# Altium project Junction Bo 42Pin Conv.PrjPcb
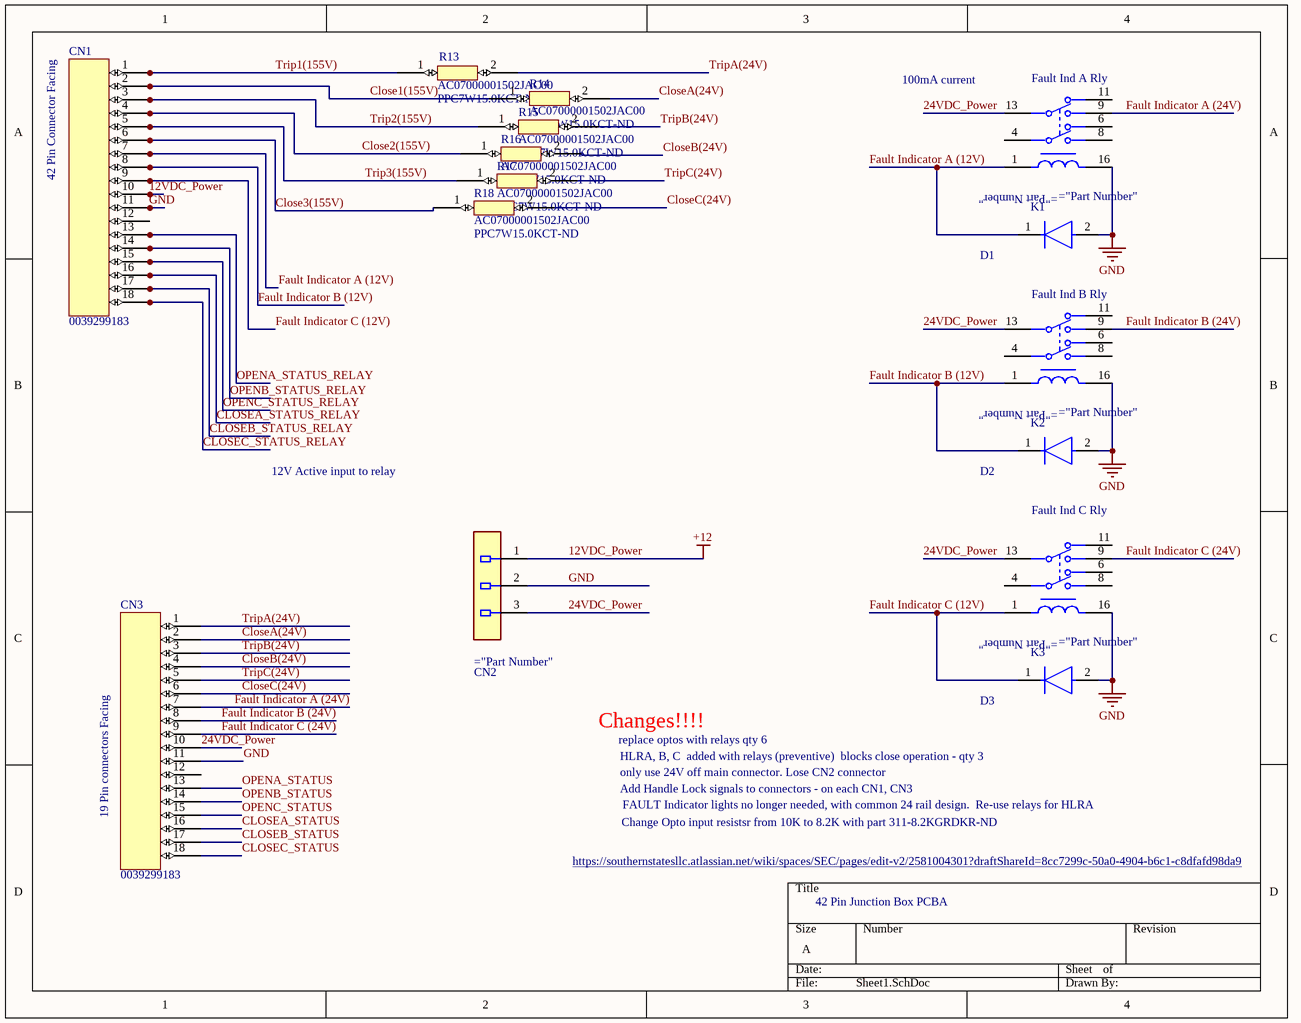
[diagram p0: Sheet1.SchDoc]
2 sheets, 45 parts. Net scope: global (net labels, ports and power ports of the same name join across sheets).
Board file: PCB1.PcbDoc
Sheets:
  Sheet1.SchDoc
  Sheet2.SchDoc

## Sheet Sheet1.SchDoc
size A; SheetNumber: 1; SheetTotal: 2

### Parts
CN1  0039299183  [0039299183]
CN2  15-31-1036  [Molex_15-31-1036_0]  (value not drawn)
CN3  0039299183  [0039299183]
D1  S1A-13-F  [Micro_Commercial_DO-214AC_MFG]  (value not drawn)
D2  S1A-13-F  [Micro_Commercial_DO-214AC_MFG]  (value not drawn)
D3  S1A-13-F  [Micro_Commercial_DO-214AC_MFG]  (value not drawn)
K1  DS2Y-S-DC24V  [Panasonic_DS2Y-S-DC24V_0]  (value not drawn)
K2  DS2Y-S-DC24V  [Panasonic_DS2Y-S-DC24V_0]  (value not drawn)
K3  DS2Y-S-DC24V  [Panasonic_DS2Y-S-DC24V_0]  (value not drawn)
R13  AC07000001502JAC00  Supplier Part Number 1: PPC7W15.0KCT-ND  [AC07000001502JAC00]
R14  AC07000001502JAC00  Supplier Part Number 1: PPC7W15.0KCT-ND  [AC07000001502JAC00]
R15  AC07000001502JAC00  Supplier Part Number 1: PPC7W15.0KCT-ND  [AC07000001502JAC00]
R16  AC07000001502JAC00  Supplier Part Number 1: PPC7W15.0KCT-ND  [AC07000001502JAC00]
R17  AC07000001502JAC00  Supplier Part Number 1: PPC7W15.0KCT-ND  [AC07000001502JAC00]
R18  AC07000001502JAC00  Supplier Part Number 1: PPC7W15.0KCT-ND  [AC07000001502JAC00]

### Nets
12VDC_Power: CN1.10 CN2.1  [also labelled +12]
GND: CN1.11 CN2.2 CN3.11 D1.2(A) D2.2(A) D3.2(A) K1.16(-) K2.16(-) K3.16(-)
24VDC_Power: CN2.3 CN3.10 K1.13(2_COM) K2.13(2_COM) K3.13(2_COM)
Close1(155V): CN1.2 R14.1
Close2(155V): CN1.4 R16.1
Close3(155V): CN1.6 R18.1
CloseA(24V): CN3.2 R14.2
CLOSEA_STATUS: CN3.16
CLOSEA_STATUS_RELAY: CN1.16
CloseB(24V): CN3.4 R16.2
CLOSEB_STATUS: CN3.17
CLOSEB_STATUS_RELAY: CN1.17
CloseC(24V): CN3.6 R18.2
CLOSEC_STATUS: CN3.18
CLOSEC_STATUS_RELAY: CN1.18
Fault Indicator A (12V): CN1.7 D1.1(C) K1.1(+)
Fault Indicator A (24V): CN3.7 K1.9(2_N.O.)
Fault Indicator B (12V): CN1.8 D2.1(C) K2.1(+)
Fault Indicator B (24V): CN3.8 K2.9(2_N.O.)
Fault Indicator C (12V): CN1.9 D3.1(C) K3.1(+)
Fault Indicator C (24V): CN3.9 K3.9(2_N.O.)
OPENA_STATUS: CN3.13
OPENA_STATUS_RELAY: CN1.13
OPENB_STATUS: CN3.14
OPENB_STATUS_RELAY: CN1.14
OPENC_STATUS: CN3.15
OPENC_STATUS_RELAY: CN1.15
Trip1(155V): CN1.1 R13.1
Trip2(155V): CN1.3 R15.1
Trip3(155V): CN1.5 R17.1
TripA(24V): CN3.1 R13.2
TripB(24V): CN3.3 R15.2
TripC(24V): CN3.5 R17.2

Not connected (* = marked no-connect by the designer): CN1 12; CN3 12; K1 4(1_COM) 6(1_N.C.) 8(1_N.O.) 11(2_N.C.); K2 4(1_COM) 6(1_N.C.) 8(1_N.O.) 11(2_N.C.); K3 4(1_COM) 6(1_N.C.) 8(1_N.O.) 11(2_N.C.)

### Notes on the sheet
- (near K1) 100mA current
- (near K1) Fault Ind A Rly
- (near CN1) 42 Pin Connector Facing
- (near K2) Fault Ind B Rly
- 12V Active input to relay
- (near K3) Fault Ind C Rly
- Changes!!!!
- replace optos with relays qty 6
- HLRA, B, C  added with relays (preventive)  blocks close operation - qty 3
- only use 24V off main connector. Lose CN2 connector
- (near CN3) 19 Pin connectors Facing
- Add Handle Lock signals to connectors - on each CN1, CN3
- Change Opto input resistsr from 10K to 8.2K with part 311-8.2KGRDKR-ND
- FAULT Indicator lights no longer needed, with common 24 rail design.  Re-use relays for HLRA
- https://southernstatesllc.atlassian.net/wiki/spaces/SEC/pages/edit-v2/2581004301?draftShareId=8cc7299c-50a0-4904-b6c1-c8dfafd98da9
- 42 Pin Junction Box PCBA

### Library data of the parts
CN1 CN3 = 0039299183 - 18 pin molex mini fit jr 5566: Connector Header Through Hole 18 position 0.165" (4.20mm)
D1-D3 = FM2000GP
R13-R18 = AC07000001502JAC00: Manufacturer: Vishay BCcomponents; Tolerance: 5%; Power Rating: 7W; Resistance: 15kR; Temperature Coefficient: 180ppm/°C; Voltage Rating: 324V; Supplier 1: Digi-Key; Manufacturer Part Number: AC07000001502JAC00; Stock 1: 0; Pricing 1: 1=2.26, 10=2.002, 25=1.8564, 50=1.7472, 100=1.5288, 250=1.3104 (USD); Mount: Through Hole; Case/Package: Axial; Number of Pins: 2; Contact Plating: Tin; Min Operating Temperature: -40°C; Max Operating Temperature: 275°C; Resistor Type: Wirewound; Package Quantity: 1; Packaging: Tape and Reel; Number of Terminations: 2; Max Power Dissipation: 7W; Voltage Rating (DC): 324V; Termination: Axial; Features: Flame Retardant Coating; Series: AC; Resistance Tolerance: 5%; Diameter: 7.5mm; Length: 1.024inch; Width: 7.49mm; Radiation Hardening: No; RoHS Compliant: Yes; ComponentLink1URL: http://www.vishay.com/docs/28730/acseries.pdf?src-supplier=Avnet; ComponentLink1Description: http://www.vishay.com/docs/28730/acseries.pdf?src-supplier=Avnet; ComponentLink2URL: http://www.vishay.com/docs/28730/acseries.pdf?src-supplier=Avnet+Europe; ComponentLink2Description: http://www.vishay.com/docs/28730/acseries.pdf?src-supplier=Avnet+Europe; ComponentLink3URL: http://www.vishay.com/docs/28730/acac-at.pdf?src-supplier=Digi-Key; ComponentLink3Description: http://www.vishay.com/docs/28730/acac-at.pdf?src-supplier=Digi-Key

## Sheet Sheet2.SchDoc
size A; SheetNumber: 2; SheetTotal: 2
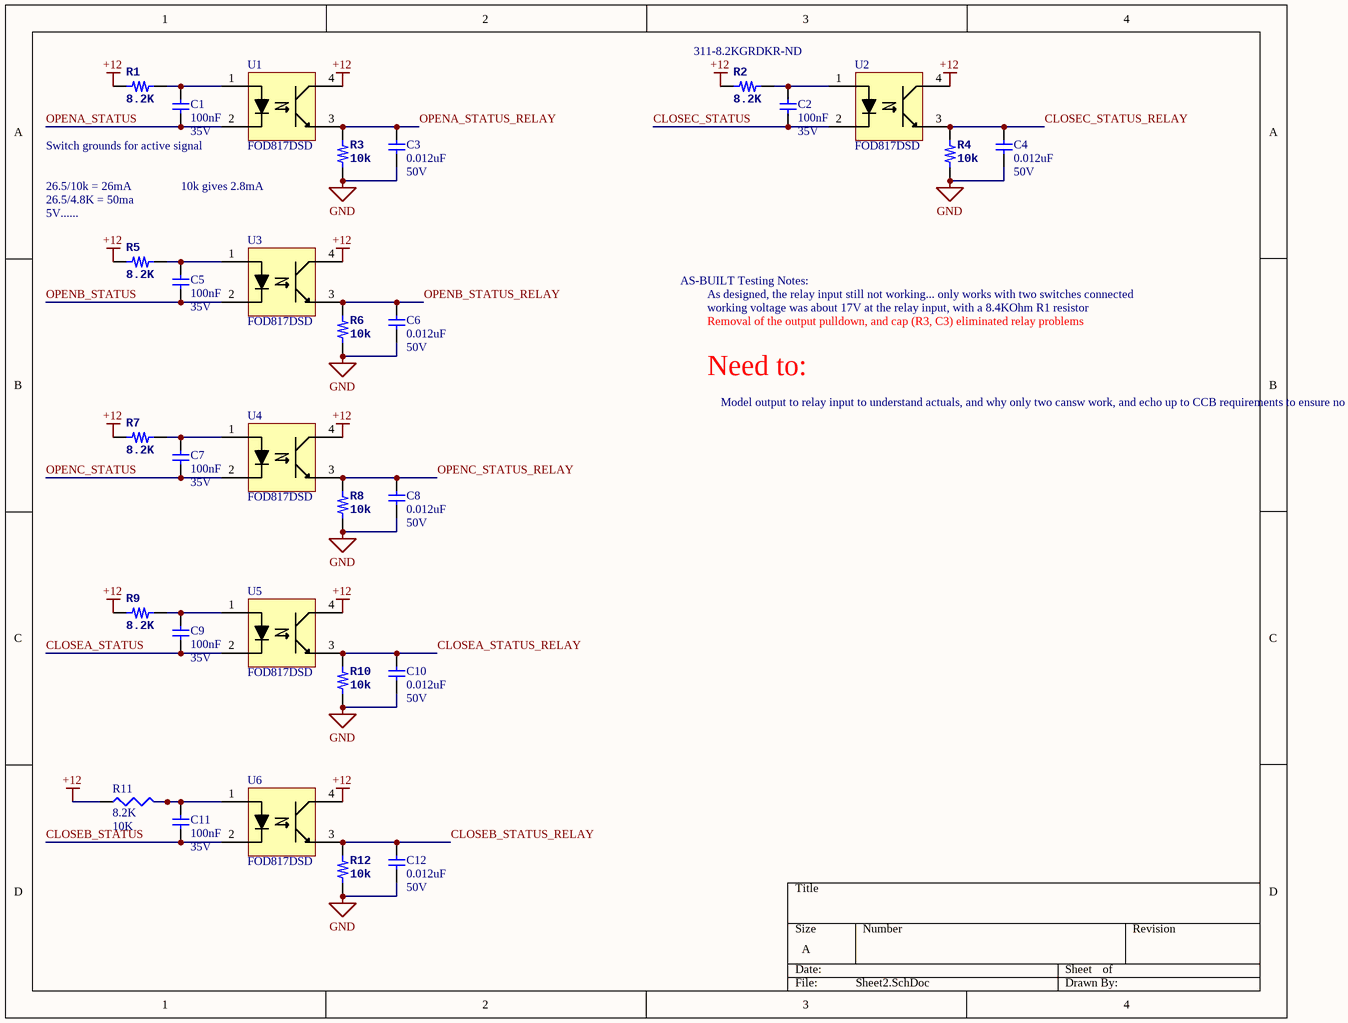
[diagram p1: Sheet2.SchDoc]

### Parts
C1  100nF  Voltage: 35V  [C0603N]
C2  100nF  Voltage: 35V  [C0603N]
C3  0.012uF  Voltage: 50V  [C0805K]
C4  0.012uF  Voltage: 50V  [C0805K]
C5  100nF  Voltage: 35V  [C0603N]
C6  0.012uF  Voltage: 50V  [C0805K]
C7  100nF  Voltage: 35V  [C0603N]
C8  0.012uF  Voltage: 50V  [C0805K]
C9  100nF  Voltage: 35V  [C0603N]
C10  0.012uF  Voltage: 50V  [C0805K]
C11  100nF  Voltage: 35V  [C0603N]
C12  0.012uF  Voltage: 50V  [C0805K]
R1  8.2K  [R0603N]
R2  8.2K  Supplier Part Number 1: 311-8.2KGRDKR-ND  [R0603N]
R3  10k  [R0603N]
R4  10k  [R0603N]
R5  8.2K  [R0603N]
R6  10k  [R0603N]
R7  8.2K  [R0603N]
R8  10k  [R0603N]
R9  8.2K  [R0603N]
R10  10k  [R0603N]
R11  8.2K  value 10K  [J1-0603]
R12  10k  [R0603N]
U1  FOD817DSD  [4-SMD GullWing]
U2  FOD817DSD  [4-SMD GullWing]
U3  FOD817DSD  [4-SMD GullWing]
U4  FOD817DSD  [4-SMD GullWing]
U5  FOD817DSD  [4-SMD GullWing]
U6  FOD817DSD  [4-SMD GullWing]

### Nets
+12: R1.2 R2.2 R5.2 R7.2 R9.2 R11.1 U1.4(C) U2.4(C) U3.4(C) U4.4(C) U5.4(C) U6.4(C)  [project net 12VDC_Power]
GND: C3.2 C4.2 C6.2 C8.2 C10.2 C12.2 R3.1 R4.1 R6.1 R8.1 R10.1 R12.1
CLOSEA_STATUS: C9.2 U5.2(C)
CLOSEA_STATUS_RELAY: C10.1 R10.2 U5.3(E)
CLOSEB_STATUS: C11.2 U6.2(C)
CLOSEB_STATUS_RELAY: C12.1 R12.2 U6.3(E)
CLOSEC_STATUS: C2.2 U2.2(C)
CLOSEC_STATUS_RELAY: C4.1 R4.2 U2.3(E)
OPENA_STATUS: C1.2 U1.2(C)
OPENA_STATUS_RELAY: C3.1 R3.2 U1.3(E)
OPENB_STATUS: C5.2 U3.2(C)
OPENB_STATUS_RELAY: C6.1 R6.2 U3.3(E)
OPENC_STATUS: C7.2 U4.2(C)
OPENC_STATUS_RELAY: C8.1 R8.2 U4.3(E)
NetC1_1: C1.1 R1.1 U1.1(A)
NetC2_1: C2.1 R2.1 U2.1(A)
NetC5_1: C5.1 R5.1 U3.1(A)
NetC7_1: C7.1 R7.1 U4.1(A)
NetC9_1: C9.1 R9.1 U5.1(A)
NetC11_1: C11.1 R11.2 U6.1(A)

### Notes on the sheet
- Switch grounds for active signal
- 26.5/10k = 26mA
- 26.5/4.8K = 50ma
- (near R5) 5V......
- 10k gives 2.8mA
- AS-BUILT Testing Notes:
- As designed, the relay input still not working... only works with two switches connected
- working voltage was about 17V at the relay input, with a 8.4KOhm R1 resistor
- Removal of the output pulldown, and cap (R3, C3) eliminated relay problems
- Need to:
- Model output to relay input to understand actuals, and why only two cansw work, and echo up to CCB requirements to ensure no future problems

### Library data of the parts
C1 C2 C5 C7 C9 C11 = CAP_0603: CAP CER 10% 0603; Temp: X7R; Part Number: ?; Manufacturer: ?; PartNumber-Prime: ?; Mount: SMT; Alternate Allowed: ?
C3 C4 C6 C8 C10 C12 = CAP_0805: CAP CER 10% 0805; PartNumber: ?; Manufacturer: ?; PartNumber-Prime: ?; Mount: SMT; Alternate Allowed: ?; Temp: ?
R1 R2 R5 R7 R9 = RES_1/10W_0603_1%: RES SMD 1/10W 0603 1%; Manufacturer: ?; Manufacturer Part Number: ?; Part Number-Prime: ?; Power: 1/10W; Tolerance: 1%; Mount: SMT; Alternate Allowed: ?
  R2: Supplier 1: Digi-Key
R3 R4 R6 R8 R10 R12 = RES_1/10W_0603_0.1%: RES SMD 1/10W 0603 0.1%; Manufacturer: ?; Manufacturer Part Number: ?; Part Number-Prime: ?; Power: 1/10W; Mount: SMT; Alternate Allowed: ?; Tolerance: 0.1%
R11 = Res3: Resistor; Published: 8-Jun-2000; LatestRevisionDate: 29-May-2009; LatestRevisionNote: IPC-7351 Footprint Added.; PackageReference: J1-0603; Publisher: Altium Limited; PackageDescription: Chip Resistor
U1-U6 = 108-00030-001: OPTOISOLATOR 5KV TRANSISTOR 4SMD; Manufacturer: Fairchild; Temp: -55C, +110C; Supplier 1: Digi-Key; Supplier Part Number 1: FOD817DSDCT-ND; Mount: SMT; Manufacturer Part Number: FOD817DSD; Part Number-Prime: ?; Price: 0.30; Part Number-ASD: 108-00030-001

## Nets that join several sheets
12VDC_Power: Sheet1 (CN1.10 CN2.1), Sheet2 (12 pins)
GND: Sheet1 (9 pins), Sheet2 (12 pins)
CLOSEA_STATUS: Sheet1 (CN3.16), Sheet2 (C9.2 U5.2)
CLOSEA_STATUS_RELAY: Sheet1 (CN1.16), Sheet2 (C10.1 R10.2 U5.3)
CLOSEB_STATUS: Sheet1 (CN3.17), Sheet2 (C11.2 U6.2)
CLOSEB_STATUS_RELAY: Sheet1 (CN1.17), Sheet2 (C12.1 R12.2 U6.3)
CLOSEC_STATUS: Sheet1 (CN3.18), Sheet2 (C2.2 U2.2)
CLOSEC_STATUS_RELAY: Sheet1 (CN1.18), Sheet2 (C4.1 R4.2 U2.3)
OPENA_STATUS: Sheet1 (CN3.13), Sheet2 (C1.2 U1.2)
OPENA_STATUS_RELAY: Sheet1 (CN1.13), Sheet2 (C3.1 R3.2 U1.3)
OPENB_STATUS: Sheet1 (CN3.14), Sheet2 (C5.2 U3.2)
OPENB_STATUS_RELAY: Sheet1 (CN1.14), Sheet2 (C6.1 R6.2 U3.3)
OPENC_STATUS: Sheet1 (CN3.15), Sheet2 (C7.2 U4.2)
OPENC_STATUS_RELAY: Sheet1 (CN1.15), Sheet2 (C8.1 R8.2 U4.3)